# Altium project Desk.PrjPCB
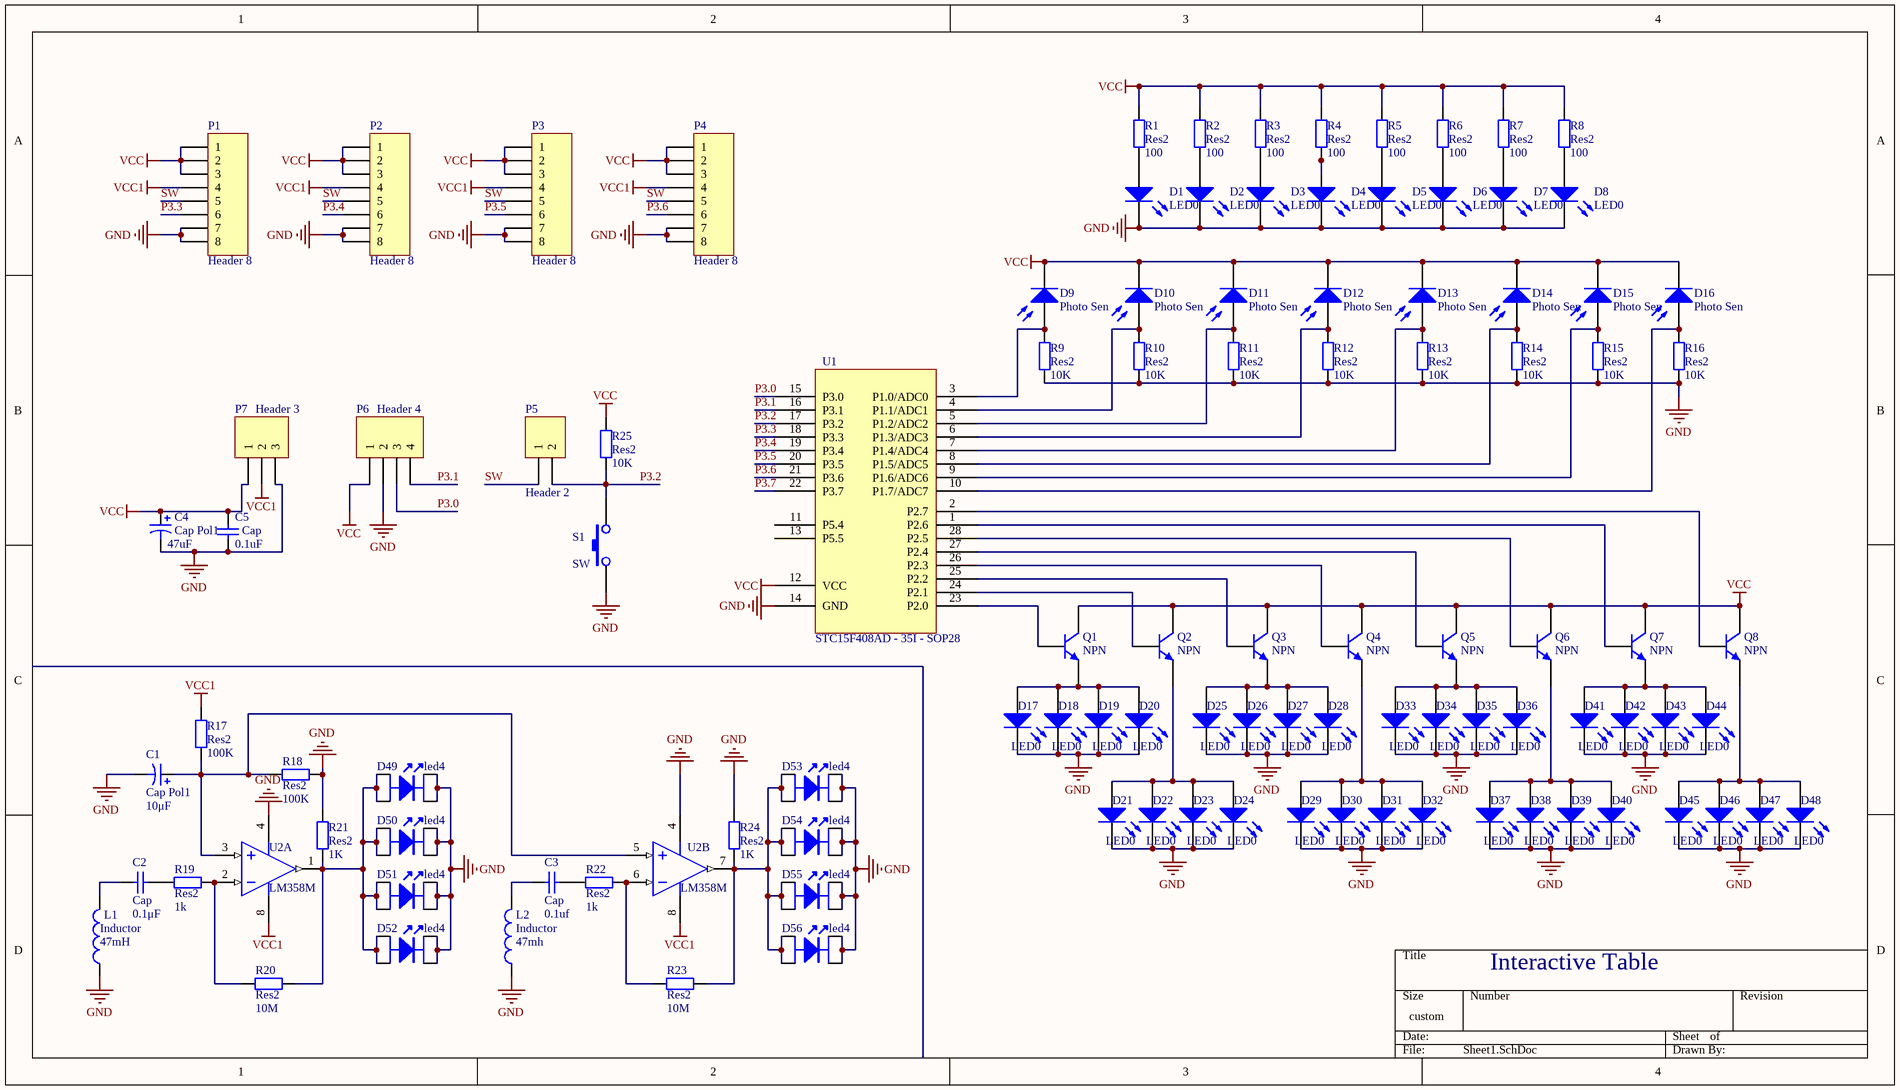
[diagram p0: Sheet1.SchDoc]
1 sheet, 106 parts. Net scope: global (net labels, ports and power ports of the same name join across sheets).
Board file: PCB1.PcbDoc

## Sheet Sheet1.SchDoc: Interactive Table
size 355 x 203 mm; DrawnBy: xiao3d; Rule: PcbType=ProtelPcb

### Parts
C1  Cap Pol1  value 10μF  [IECP10 W]
C2  Cap  value 0.1μF  [iCap]
C3  Cap  value 0.1uf  [iCap]
C4  Cap Pol1  value 47uF  [IECP10 W]
C5  Cap  value 0.1uF  [iCap]
D1  LED0  [iLED_IR]
D2  LED0  [iLED_IR]
D3  LED0  [iLED_IR]
D4  LED0  [iLED_IR]
D5  LED0  [iLED_IR]
D6  LED0  [iLED_IR]
D7  LED0  [iLED_IR]
D8  LED0  [iLED_IR]
D9  Photo Sen  [iLED_PS]
D10  Photo Sen  [iLED_PS]
D11  Photo Sen  [iLED_PS]
D12  Photo Sen  [iLED_PS]
D13  Photo Sen  [iLED_PS]
D14  Photo Sen  [iLED_PS]
D15  Photo Sen  [iLED_PS]
D16  Photo Sen  [iLED_PS]
D17  LED0  [iLED]
D18  LED0  [iLED]
D19  LED0  [iLED]
D20  LED0  [iLED]
D21  LED0  [iLED]
D22  LED0  [iLED]
D23  LED0  [iLED]
D24  LED0  [iLED]
D25  LED0  [iLED]
D26  LED0  [iLED]
D27  LED0  [iLED]
D28  LED0  [iLED]
D29  LED0  [iLED]
D30  LED0  [iLED]
D31  LED0  [iLED]
D32  LED0  [iLED]
D33  LED0  [iLED]
D34  LED0  [iLED]
D35  LED0  [iLED]
D36  LED0  [iLED]
D37  LED0  [iLED]
D38  LED0  [iLED]
D39  LED0  [iLED]
D40  LED0  [iLED]
D41  LED0  [iLED]
D42  LED0  [iLED]
D43  LED0  [iLED]
D44  LED0  [iLED]
D45  LED0  [iLED]
D46  LED0  [iLED]
D47  LED0  [iLED]
D48  LED0  [iLED]
D49  led4
D50  led4
D51  led4
D52  led4
D53  led4
D54  led4
D55  led4
D56  led4
L1  Inductor  value 47mH  [iL]
L2  Inductor  value 47mh  [iL]
P1  Header 8  [HDR1X8H]
P2  Header 8  [HDR1X8H]
P3  Header 8  [HDR1X8]
P4  Header 8  [HDR1X8]
P5  Header 2  [HDR1X2]
P6  Header 4  [HDR1X4]
P7  Header 3  [HBX3P]
Q1  NPN  [NPN]
Q2  NPN  [NPN]
Q3  NPN  [NPN]
Q4  NPN  [NPN]
Q5  NPN  [NPN]
Q6  NPN  [NPN]
Q7  NPN  [NPN]
Q8  NPN  [NPN]
R1  Res2  value 100  [AXIAL-0.4]
R2  Res2  value 100  [AXIAL-0.4]
R3  Res2  value 100  [AXIAL-0.4]
R4  Res2  value 100  [AXIAL-0.4]
R5  Res2  value 100  [AXIAL-0.4]
R6  Res2  value 100  [AXIAL-0.4]
R7  Res2  value 100  [AXIAL-0.4]
R8  Res2  value 100  [AXIAL-0.4]
R9  Res2  value 10K  [AXIAL-0.4]
R10  Res2  value 10K  [AXIAL-0.4]
R11  Res2  value 10K  [AXIAL-0.4]
R12  Res2  value 10K  [AXIAL-0.4]
R13  Res2  value 10K  [AXIAL-0.4]
R14  Res2  value 10K  [AXIAL-0.4]
R15  Res2  value 10K  [AXIAL-0.4]
R16  Res2  value 10K  [AXIAL-0.4]
R17  Res2  value 100K  [AXIAL-0.4]
R18  Res2  value 100K  [AXIAL-0.4]
R19  Res2  value 1k  [AXIAL-0.4]
R20  Res2  value 10M  [AXIAL-0.4]
R21  Res2  value 1K  [AXIAL-0.4]
R22  Res2  value 1k  [AXIAL-0.4]
R23  Res2  value 10M  [AXIAL-0.4]
R24  Res2  value 1K  [AXIAL-0.4]
R25  Res2  value 10K  [AXIAL-0.4]
S1  SW  [SW]
U1  STC15F408AD - 35I - SOP28  [SOP28]
U2  LM358M  [M08A_N]  (parts A,B of 2)

### Nets
GND: C1.2 C4.2 C5.1 D1.2(K) D2.2(K) D3.2(K) D4.2(K) D5.2(K) D6.2(K) D7.2(K) D8.2(K) D17.2(K) D18.2(K) D19.2(K) D20.2(K) D21.2(K) D22.2(K) D23.2(K) D24.2(K) D25.2(K) D26.2(K) D27.2(K) D28.2(K) D29.2(K) D30.2(K) D31.2(K) D32.2(K) D33.2(K) D34.2(K) D35.2(K) D36.2(K) D37.2(K) D38.2(K) D39.2(K) D40.2(K) D41.2(K) D42.2(K) D43.2(K) D44.2(K) D45.2(K) D46.2(K) D47.2(K) D48.2(K) D49.3 D49.4 D50.3 D50.4 D51.3 D51.4 D52.3 D52.4 D53.3 D53.4 D54.3 D54.4 D55.3 D55.4 D56.3 D56.4 L1.1 L2.1 P1.7 P1.8 P2.7 P2.8 P3.7 P3.8 P4.7 P4.8 P6.2 P7.3 R9.1 R10.1 R11.1 R12.1 R13.1 R14.1 R15.1 R16.1 R18.2 R21.1 R24.2 S1.1 U1.14(GND) U2.4(GND)
VCC: C4.1 C5.2 D9.2(K) D10.2(K) D11.2(K) D12.2(K) D13.2(K) D14.2(K) D15.2(K) D16.2(K) P1.1 P1.2 P1.3 P2.1 P2.2 P2.3 P3.1 P3.2 P3.3 P4.1 P4.2 P4.3 P6.1 P7.1 Q1.1(C) Q2.1(C) Q3.1(C) Q4.1(C) Q5.1(C) Q6.1(C) Q7.1(C) Q8.1(C) R1.2 R2.2 R3.2 R4.2 R5.2 R6.2 R7.2 R8.2 R25.2 U1.12(VCC)
VCC1: P1.4 P2.4 P3.4 P4.4 P7.2 R17.2 U2.8(V+)
P3.0: P6.3 U1.15(P3.0)
P3.1: P6.4 U1.16(P3.1)
P3.2: P5.2 R25.1 S1.2 U1.17(P3.2)
P3.3: P1.6 U1.18(P3.3)
P3.4: P2.6 U1.19(P3.4)
P3.5: P3.6 U1.20(P3.5)
P3.6: P4.6 U1.21(P3.6)
P3.7: U1.22(P3.7)
SW: P1.5 P2.5 P3.5 P4.5 P5.1
NetC1_1: C1.1 R17.1 R18.1 U2.3(INA+) U2.5(INB+)
NetC2_1: C2.1 L1.2
NetC2_2: C2.2 R19.2
NetC3_1: C3.1 L2.2
NetC3_2: C3.2 R22.1
NetD1_1: D1.1(A) R1.1
NetD2_1: D2.1(A) R2.1
NetD3_1: D3.1(A) R3.1
NetD4_1: D4.1(A) R4.1
NetD5_1: D5.1(A) R5.1
NetD6_1: D6.1(A) R6.1
NetD7_1: D7.1(A) R7.1
NetD8_1: D8.1(A) R8.1
NetD9_1: D9.1(A) R9.2 U1.3(P1.0/ADC0)
NetD10_1: D10.1(A) R10.2 U1.4(P1.1/ADC1)
NetD11_1: D11.1(A) R11.2 U1.5(P1.2/ADC2)
NetD12_1: D12.1(A) R12.2 U1.6(P1.3/ADC3)
NetD13_1: D13.1(A) R13.2 U1.7(P1.4/ADC4)
NetD14_1: D14.1(A) R14.2 U1.8(P1.5/ADC5)
NetD15_1: D15.1(A) R15.2 U1.9(P1.6/ADC6)
NetD16_1: D16.1(A) R16.2 U1.10(P1.7/ADC7)
NetD17_1: D17.1(A) D18.1(A) D19.1(A) D20.1(A) Q1.3(E)
NetD21_1: D21.1(A) D22.1(A) D23.1(A) D24.1(A) Q2.3(E)
NetD25_1: D25.1(A) D26.1(A) D27.1(A) D28.1(A) Q3.3(E)
NetD29_1: D29.1(A) D30.1(A) D31.1(A) D32.1(A) Q4.3(E)
NetD33_1: D33.1(A) D34.1(A) D35.1(A) D36.1(A) Q5.3(E)
NetD37_1: D37.1(A) D38.1(A) D39.1(A) D40.1(A) Q6.3(E)
NetD41_1: D41.1(A) D42.1(A) D43.1(A) D44.1(A) Q7.3(E)
NetD45_1: D45.1(A) D46.1(A) D47.1(A) D48.1(A) Q8.3(E)
NetD49_1: D49.1 D49.2 D50.1 D50.2 D51.1 D51.2 D52.1 D52.2 R20.1 R21.2 U2.1(OUTA)
NetD53_1: D53.1 D53.2 D54.1 D54.2 D55.1 D55.2 D56.1 D56.2 R23.2 R24.1 U2.7(OUTB)
NetQ1_2: Q1.2(B) U1.23(P2.0)
NetQ2_2: Q2.2(B) U1.24(P2.1)
NetQ3_2: Q3.2(B) U1.25(P2.2)
NetQ4_2: Q4.2(B) U1.26(P2.3)
NetQ5_2: Q5.2(B) U1.27(P2.4)
NetQ6_2: Q6.2(B) U1.28(P2.5)
NetQ7_2: Q7.2(B) U1.1(P2.6)
NetQ8_2: Q8.2(B) U1.2(P2.7)
NetR19_1: R19.1 R20.2 U2.2(INA-)
NetR22_2: R22.2 R23.1 U2.6(INB-)

Not connected (* = marked no-connect by the designer): U1 11(P5.4) 13(P5.5)

### Library data of the parts
C1 C4 = Cap Pol1: Polarized Capacitor (Radial); Published: 8-Jun-2000; LatestRevisionDate: 17-Jul-2002; LatestRevisionNote: Re-released for DXP Platform.; PackageReference: RB7.6-15; Publisher: Altium Limited
  C1: PackageDescription: Polarized Capacitor (Radial); 2 Leads
C2 C3 C5 = Cap: Capacitor; Published: 8-Jun-2000; LatestRevisionDate: 17-Jul-2002; LatestRevisionNote: Re-released for DXP Platform.; PackageReference: RAD-0.3; Publisher: Altium Limited
  C2 C3: PackageDescription: Radial Cap, Thru-Hole; 2 Leads; 0.3 in Pin Spacing
D1-D8 D17-D48 = LED0: Typical INFRARED GaAs LED; Published: 8-Jun-2000; LatestRevisionDate: 08-Jul-2005; LatestRevisionNote: Mech Layer 1 removed.; PackageReference: LED-0; Publisher: Altium Limited
D9-D16 = Photo Sen: Photosensitive Diode; Published: 24-Mar-1999; LatestRevisionDate: 17-Jul-2002; LatestRevisionNote: Re-released for DXP Platform.; PackageReference: PIN2; Publisher: Altium Limited
L1 L2 = Inductor: Code_IEC: 1005; Published: 8-Jun-2000; LatestRevisionDate: 29-May-2009; LatestRevisionNote: IPC-7351 Footprint Added.; PackageReference: 0402-A; Publisher: Altium Limited; PackageDescription: Chip Inductor; Code_JEITA: 0402
P1-P4 = Header 8: Header, 8-Pin; LatestRevisionDate: 17-Jul-2002; LatestRevisionNote: Re-released for DXP Platform.; Publisher: Altium Limited
P5 = Header 2: Header, 2-Pin; LatestRevisionDate: 17-Jul-2002; LatestRevisionNote: Re-released for DXP Platform.; Publisher: Altium Limited
P6 = Header 4: Header, 4-Pin; LatestRevisionDate: 17-Jul-2002; LatestRevisionNote: Re-released for DXP Platform.; Publisher: Altium Limited
P7 = Header 3: Header, 3-Pin; LatestRevisionDate: 17-Jul-2002; LatestRevisionNote: Re-released for DXP Platform.; Publisher: Altium Limited
Q1-Q8 = NPN: NPN Bipolar Transistor; Published: 8-Jun-2000; LatestRevisionDate: 17-Jul-2002; LatestRevisionNote: Re-released for DXP Platform.; PackageReference: TO-226; Publisher: Altium Limited; Code_JEDEC: TO-226-AA
R1-R25 = Res2: Resistor; Published: 8-Jun-2000; LatestRevisionDate: 17-Jul-2002; LatestRevisionNote: Re-released for DXP Platform.; PackageReference: AXIAL-0.4; Publisher: Altium Limited
  R17-R24: PackageDescription: Axial Device, Thru-Hole; 2 Leads; 0.4 in Pin Spacing
S1 = 微动开关
U2 = LM358M: Low Power Dual Operational Amplifier; Manufacturer: National Semiconductor; CompType: Amplifiers; PackageTopMarking: NSZXTT*LM*358M; PowerWise: N; Published: 4-Dec-2008; LatestRevisionDate: 13-Jan-2009; LatestRevisionNote: Sim Model Added.; DatasheetVersion: Oct-2005; PackageVersion: revL, Sep-2006; PackageReference: M08A; Publisher: Altium Limited; PackageDescription: SOIC Narrow, 4.9 x 3.9 x 1.45mm, 8 Lead, 1.27mm Pitch; PartNumber: LM358M; RoHS: O; PinCount: 8; DigiKeyPartNumber: LM358MXCT-ND; Code_JEDEC: MS-012-AA; Code_IPC: SOIC127P600-8; ComponentLink1Description: LM358 Datasheet; ComponentLink1URL: http://www.national.com/ds/LM/LM358.pdf; ComponentLink2Description: LM358 Web Page; ComponentLink2URL: http://www.national.com/pf/LM/LM358.html; ComponentLink3Description: M08A Package Page; ComponentLink3URL: http://www.national.com/packaging/folders/m08a.html